# Altium schematic sheet Xiaoyun2333_CH340-USB-Downloader__hardware__ch340.schdoc
size 198 x 116 mm
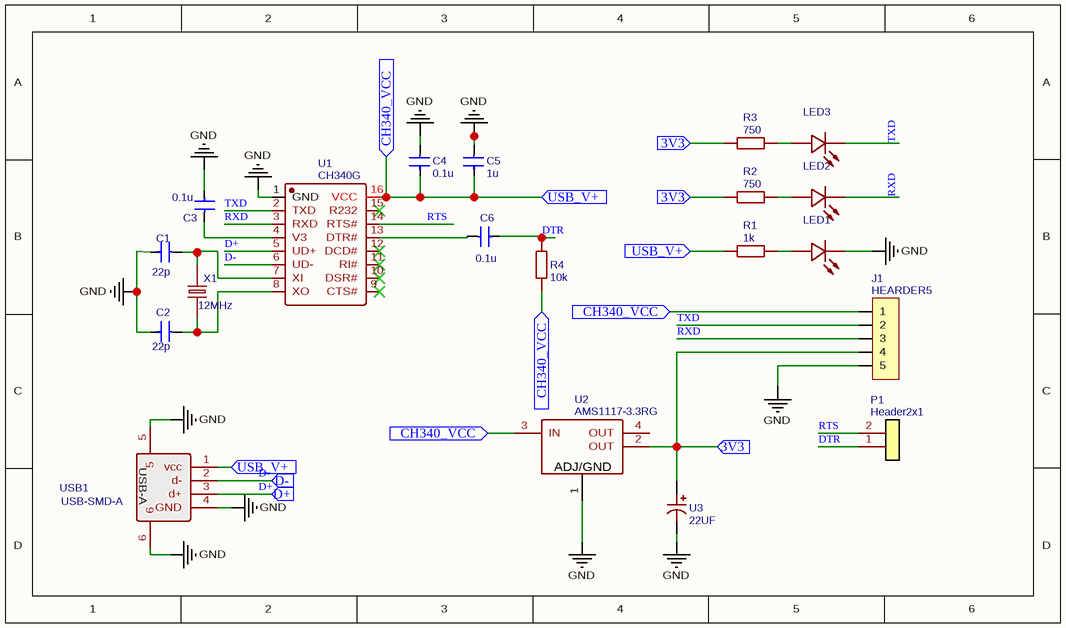
[diagram p0: Xiaoyun2333_CH340-USB-Downloader__hardware__ch340.schdoc]

## Parts
C1  22p  [C0805]
C2  22p  [C0805]
C3  0.1u  [C0805]
C4  0.1u  [C0805]
C5  1u  [C0805]
C6  0.1u  [C0805]
J1  HEARDER5  [HDR1X5]
LED1  LED0805  [LED0805-RD]  (value not drawn)
LED2  LED0805  [LED0805-RD]  (value not drawn)
LED3  LED0805  [LED0805-RD]  (value not drawn)
P1  Header2x1  [HEADER2X1]
R1  1k  [R0805]
R2  750  [R0805]
R3  750  [R0805]
R4  10k  [R0805]
U1  CH340G  [SOP16L]
U2  AMS1117-3.3RG  [SOT-223-3_L6.4-W3.5-P2.30-LS7.0-BR]
U3  22UF  [CAP-SMD_L3.2-W1.6-FD-1]
USB1  USB-SMD-A  [USB-A-SMD_U-G-04WS-W-01]
X1  12MHz  [HC-49S_L11.4-W4.8]

## Ports
3V3 (in), CH340_VCC (in), D+ (in), D- (in), USB_V+ (in)

## Nets
GND: C1.2 C2.2 C3.2 C4.1 C5.1 J1.5 LED1.1(-) U1.1(GND) U2.1(ADJ/GND) U3.2 USB1.4(GND) USB1.5 USB1.6
3V3: J1.4 R2.2 R3.2 U2.2(OUT) U3.1 ; port 3V3
CH340_VCC: C4.2 C5.2 J1.1 R1.2 R4.2 U1.16(VCC) U2.3(IN) USB1.1(vcc) ; port USB_V+, port CH340_VCC
D+: U1.5(UD+) USB1.3(d+) ; port D+
D-: U1.6(UD-) USB1.2(d-) ; port D-
DTR: C6.2 P1.1 R4.1
RTS: P1.2 U1.14(RTS#)
RXD: J1.3 LED2.1(-) U1.3(RXD)
TXD: J1.2 LED3.1(-) U1.2(TXD)
NetC1_1: C1.1 U1.7(XI) X1.2
NetC2_1: C2.1 U1.8(XO) X1.1
NetC3_1: C3.1 U1.4(V3)
NetC6_1: C6.1 U1.13(DTR#)
NetLED1_2: LED1.2(+) R1.1
NetLED2_2: LED2.2(+) R2.1
NetLED3_2: LED3.2(+) R3.1

Not connected (* = marked no-connect by the designer): U1 9(CTS#)* 10(DSR#)* 11(RI#)* 12(DCD#)* 15(R232)*; U2 4(OUT)

## Notes on the sheet
- (in symbol USB-SMD-A) USB-A

## Library data of the parts
C1 C2 = 22p: Contributor: gaoziting; spicePre: C; spiceSymbolName: C0805
C3 C4 C6 = 0.1u: Contributor: gaoziting; spicePre: C; spiceSymbolName: C0805
C5 = 1u: Contributor: gaoziting; spicePre: C; spiceSymbolName: C0805
J1 = HEARDER5: Contributor: lhl234; spicePre: J; spiceSymbolName: HEARDER5
LED1-LED3 = LED0805: BOM_Manufacturer: null; Contributor: LCSC; BOM_Supplier: LCSC; BOM_Supplier Part: C9900012722; BOM_Manufacturer Part: led0805; BOM_JLCPCB Part Class: Extended Part; spicePre: L; spiceSymbolName: LED0805
P1 = Header2x1: Contributor: RenWL; spicePre: P; spiceSymbolName: Header2x1
R1 = 1k: BOM_Manufacturer: null; BOM_Manufacturer Part: 0805; Contributor: LCSC; BOM_Supplier: LCSC; BOM_Supplier Part: C9900012715; link: https://atta.szlcsc.comnull; BOM_JLCPCB Part Class: Extended Part; spicePre: R; spiceSymbolName: 0805
R2 R3 = 750: BOM_Manufacturer: null; BOM_Manufacturer Part: 0805; Contributor: LCSC; BOM_Supplier: LCSC; BOM_Supplier Part: C9900012715; link: https://atta.szlcsc.comnull; BOM_JLCPCB Part Class: Extended Part; spicePre: R; spiceSymbolName: 0805
R4 = 10k: BOM_Manufacturer: null; BOM_Manufacturer Part: 0805; Contributor: LCSC; BOM_Supplier: LCSC; BOM_Supplier Part: C9900012715; link: https://atta.szlcsc.comnull; BOM_JLCPCB Part Class: Extended Part; spicePre: R; spiceSymbolName: 0805
U1 = CH340G: BOM_Manufacturer: WCH(南京沁恒); timeStamp: 1468327462; BOM_Supplier: LCSC; BOM_Manufacturer Part: CH340G; BOM_Supplier Part: C14267; BOM_JLCPCB Part Class: Extended Part; spicePre: U; spiceSymbolName: CH340G
U2 = AMS1117-3.3RG: BOM_Manufacturer: HGC(深圳汉芯); Contributor: lcsc; BOM_Supplier: LCSC; BOM_Supplier Part: C2977152; BOM_Manufacturer Part: AMS1117-3.3RG; link: https://atta.szlcsc.com/upload/public/pdf/source/20220421/831A1120B7CD5BB25BF1AD9EB84373E2.pdf; BOM_JLCPCB Part Class: Extended Part; spicePre: U; spiceSymbolName: AMS1117-3.3RG
U3 = 22UF: BOM_Manufacturer: null; BOM_Manufacturer Part: 22uF/10V,±10%,1206,钽电容; Contributor: LCSC; BOM_Supplier: LCSC; BOM_Supplier Part: C9900004911; BOM_JLCPCB Part Class: Extended Part; spicePre: U; spiceSymbolName: 22UF/10V,±10%,1206
USB1 = USB-SMD-A: BOM_Manufacturer: 韩国韩荣; BOM_Manufacturer Part: U-G-04WS-W-01; BOM_Supplier: LCSC; BOM_Supplier Part: C97324; BOM_JLCPCB Part Class: Extended Part; spicePre: U; spiceSymbolName: U-G-04WS-W-01
X1 = 12MHz: BOM_Manufacturer: TAE(雅晶鑫); BOM_Manufacturer Part: TAXM12M2GLFBET2T; nameAlias: Frequency; BOM_Supplier: LCSC; BOM_Supplier Part: C111117; BOM_JLCPCB Part Class: Extended Part; spicePre: X; spiceSymbolName: HC-49SM12MHz20pF30ppm